# Altium schematic sheet SM3320-BATT-EV.SchDoc: ChangeMe
size C; Date: Not shown in title block; ApprovedBy: Not shown in title block; CheckedBy: Not shown in title block; Author: Not shown in title block; CompanyName: Not shown in title block; DrawnBy: Not shown in title block; Engineer: Not shown in title block; Organization: Not shown in title block; Address1: Not shown in title block; Address2: Not shown in title block; Address3: Not shown in title block; Address4: Not shown in title block; DocumentNumber: 1; Revision: Use project parameter SCH_Rev; SheetNumber: 1; SheetTotal: 1; PageSetup: Record=PageOptions|CenterHorizontal=True|CenterVertical=True|PrintScale=0.85|XCorrection=0.00|YCorrection=0.00|PrintKind=2|BorderSize=5000000|LeftOffset=0|BottomOffset=0|Orientation=2|PaperLength=1000|PaperWidth=1000|Scale=100|PaperSource=15|PrintQuality=600|MediaType=1|DitherType=10|PaperKind=11x17|PrintScaleMode=0; CurrentTime: Not shown in title block; CurrentDate: Not shown in title block; Time: Not shown in title block; DocumentFullPathAndName: Not shown in title block; DocumentName: Not shown in title block; ModifiedDate: Not shown in title block; ImagePath: Not shown in title block
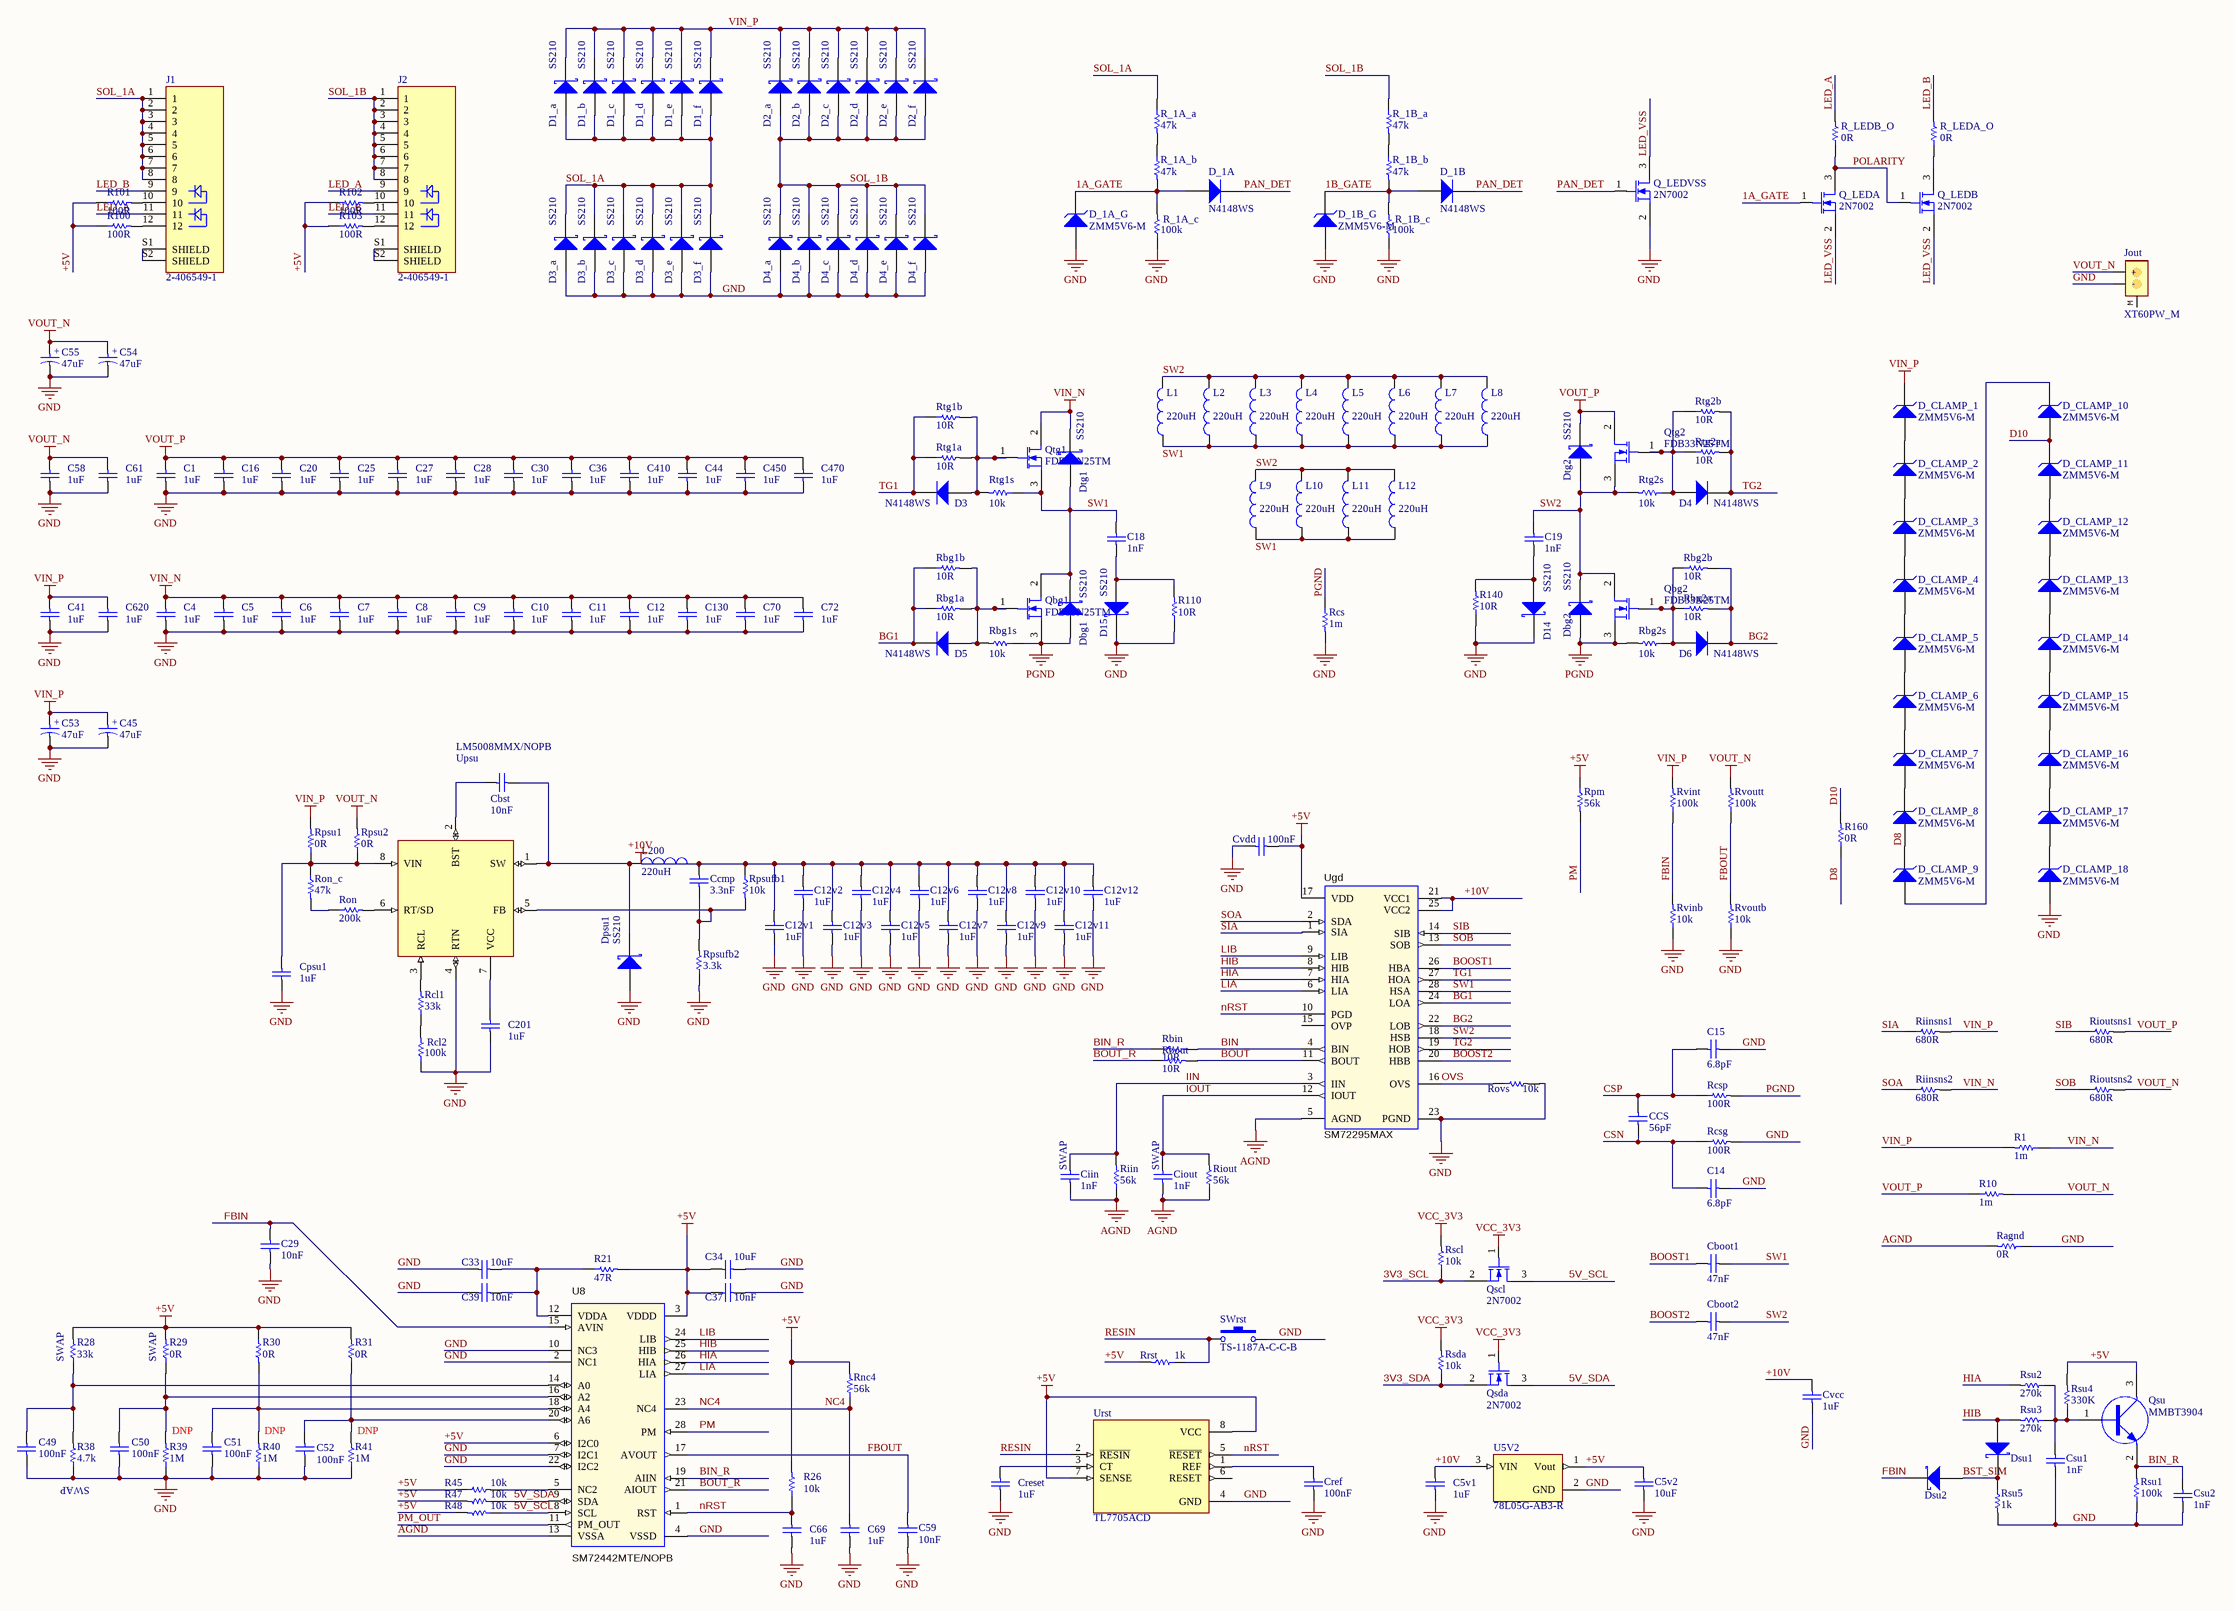
[diagram p0: SM3320-BATT-EV.SchDoc]

## Parts
C1  value 1uF  [C_1206]  (hidden comment: 1206B105K101NT)
C4  value 1uF  [C_1206]  (hidden comment: 1206B105K101NT)
C5  value 1uF  [C_1206]  (hidden comment: 1206B105K101NT)
C5v1  value 1uF  [C_0402]  (hidden comment: CL05A105KA5NQNC)
C5v2  value 10uF  [C_0402]  (hidden comment: CL05A106MQ5NUNC)
C6  value 1uF  [C_1206]  (hidden comment: 1206B105K101NT)
C7  value 1uF  [C_1206]  (hidden comment: 1206B105K101NT)
C8  value 1uF  [C_1206]  (hidden comment: 1206B105K101NT)
C9  value 1uF  [C_1206]  (hidden comment: 1206B105K101NT)
C10  value 1uF  [C_1206]  (hidden comment: 1206B105K101NT)
C11  value 1uF  [C_1206]  (hidden comment: 1206B105K101NT)
C12  value 1uF  [C_1206]  (hidden comment: 1206B105K101NT)
C12v1  value 1uF  [C_0402]  (hidden comment: CL05A105KA5NQNC)
C12v2  value 1uF  [C_0402]  (hidden comment: CL05A105KA5NQNC)
C12v3  value 1uF  [C_0402]  (hidden comment: CL05A105KA5NQNC)
C12v4  value 1uF  [C_0402]  (hidden comment: CL05A105KA5NQNC)
C12v5  value 1uF  [C_0402]  (hidden comment: CL05A105KA5NQNC)
C12v6  value 1uF  [C_0402]  (hidden comment: CL05A105KA5NQNC)
C12v7  value 1uF  [C_0402]  (hidden comment: CL05A105KA5NQNC)
C12v8  value 1uF  [C_0402]  (hidden comment: CL05A105KA5NQNC)
C12v9  value 1uF  [C_0402]  (hidden comment: CL05A105KA5NQNC)
C12v10  value 1uF  [C_0402]  (hidden comment: CL05A105KA5NQNC)
C12v11  value 1uF  [C_0402]  (hidden comment: CL05A105KA5NQNC)
C12v12  value 1uF  [C_0402]  (hidden comment: CL05A105KA5NQNC)
C14  value 6.8pF  [C_0402]  (hidden comment: 0402CG6R8C500NT)
C15  value 6.8pF  [C_0402]  (hidden comment: 0402CG6R8C500NT)
C16  value 1uF  [C_1206]  (hidden comment: 1206B105K101NT)
C18  value 1nF  [C_1206]  (hidden comment: 1206B102K202NT)
C19  value 1nF  [C_1206]  (hidden comment: 1206B102K202NT)
C20  value 1uF  [C_1206]  (hidden comment: 1206B105K101NT)
C25  value 1uF  [C_1206]  (hidden comment: 1206B105K101NT)
C27  value 1uF  [C_1206]  (hidden comment: 1206B105K101NT)
C28  value 1uF  [C_1206]  (hidden comment: 1206B105K101NT)
C29  value 10nF  [C_0402]  (hidden comment: CL05B103KB5NNNC)
C30  value 1uF  [C_1206]  (hidden comment: 1206B105K101NT)
C33  value 10uF  [C_0402]  (hidden comment: CL05A106MQ5NUNC)
C34  value 10uF  [C_0402]  (hidden comment: CL05A106MQ5NUNC)
C36  value 1uF  [C_1206]  (hidden comment: 1206B105K101NT)
C37  value 10nF  [C_0402]  (hidden comment: CL05B103KB5NNNC)
C39  value 10nF  [C_0402]  (hidden comment: CL05B103KB5NNNC)
C41  value 1uF  [C_1206]  (hidden comment: 1206B105K101NT)
C44  value 1uF  [C_1206]  (hidden comment: 1206B105K101NT)
C45  value 47uF  [C_CAN_1010]  (hidden comment: VZH470M2ATR-1010)
C49  value 100nF  [C_0402]  (hidden comment: CL05B104KO5NNNC)
C50  value 100nF  [C_0402]  (hidden comment: CL05B104KO5NNNC)
C51  value 100nF  [C_0402]  (hidden comment: CL05B104KO5NNNC)
C52  value 100nF  [C_0402]  (hidden comment: CL05B104KO5NNNC)
C53  value 47uF  [C_CAN_1010]  (hidden comment: VZH470M2ATR-1010)
C54  value 47uF  [C_CAN_1010]  (hidden comment: VZH470M2ATR-1010)
C55  value 47uF  [C_CAN_1010]  (hidden comment: VZH470M2ATR-1010)
C58  value 1uF  [C_1206]  (hidden comment: 1206B105K101NT)
C59  value 10nF  [C_0402]  (hidden comment: CL05B103KB5NNNC)
C61  value 1uF  [C_1206]  (hidden comment: 1206B105K101NT)
C66  value 1uF  [C_0402]  (hidden comment: CL05A105KA5NQNC)
C69  value 1uF  [C_0402]  (hidden comment: CL05A105KA5NQNC)
C70  value 1uF  [C_1206]  (hidden comment: 1206B105K101NT)
C72  value 1uF  [C_1206]  (hidden comment: 1206B105K101NT)
C130  value 1uF  [C_1206]  (hidden comment: 1206B105K101NT)
C201  value 1uF  [C_0402]  (hidden comment: CL05A105KA5NQNC)
C410  value 1uF  [C_1206]  (hidden comment: 1206B105K101NT)
C450  value 1uF  [C_1206]  (hidden comment: 1206B105K101NT)
C470  value 1uF  [C_1206]  (hidden comment: 1206B105K101NT)
C620  value 1uF  [C_1206]  (hidden comment: 1206B105K101NT)
Cboot1  value 47nF  [C_0603]  (hidden comment: CL10B474KA8NNNC)
Cboot2  value 47nF  [C_0603]  (hidden comment: CL10B474KA8NNNC)
Cbst  value 10nF  [C_0402]  (hidden comment: CL05B103KB5NNNC)
Ccmp  value 3.3nF  [C_0402]  (hidden comment: CL05B332KB5NNNC)
CCS  value 56pF  [C_0402]  (hidden comment: 0402CG560J500NT)
Ciin  value 1nF  [C_0402]  (hidden comment: 0402B102K500NT)
Ciout  value 1nF  [C_0402]  (hidden comment: 0402B102K500NT)
Cpsu1  value 1uF  [C_1206]  (hidden comment: 1206B105K101NT)
Cref  value 100nF  [C_0402]  (hidden comment: CL05B104KO5NNNC)
Creset  value 1uF  [C_0402]  (hidden comment: CL05A105KA5NQNC)
Csu1  value 1nF  [C_0402]  (hidden comment: 0402B102K500NT)
Csu2  value 1nF  [C_0402]  (hidden comment: 0402B102K500NT)
Cvcc  value 1uF  [C_0402]  (hidden comment: CL05A105KA5NQNC)
Cvdd  value 100nF  [C_0402]  (hidden comment: CL05B104KO5NNNC)
D1_a  SS210  [DO-214AC]
D1_b  SS210  [DO-214AC]
D1_c  SS210  [DO-214AC]
D1_d  SS210  [DO-214AC]
D1_e  SS210  [DO-214AC]
D1_f  SS210  [DO-214AC]
D2_a  SS210  [DO-214AC]
D2_b  SS210  [DO-214AC]
D2_c  SS210  [DO-214AC]
D2_d  SS210  [DO-214AC]
D2_e  SS210  [DO-214AC]
D2_f  SS210  [DO-214AC]
D3  N4148WS  [SOD-323]
D3_a  SS210  [DO-214AC]
D3_b  SS210  [DO-214AC]
D3_c  SS210  [DO-214AC]
D3_d  SS210  [DO-214AC]
D3_e  SS210  [DO-214AC]
D3_f  SS210  [DO-214AC]
D4  N4148WS  [SOD-323]
D4_a  SS210  [DO-214AC]
D4_b  SS210  [DO-214AC]
D4_c  SS210  [DO-214AC]
D4_d  SS210  [DO-214AC]
D4_e  SS210  [DO-214AC]
D4_f  SS210  [DO-214AC]
D5  N4148WS  [SOD-323]
D6  N4148WS  [SOD-323]
D14  SS210  [DO-214AC]
D15  SS210  [DO-214AC]
D_1A  N4148WS  [SOD-323]
D_1A_G  ZMM5V6-M  [DO-213AA]
D_1B  N4148WS  [SOD-323]
D_1B_G  ZMM5V6-M  [DO-213AA]
D_CLAMP_1  ZMM5V6-M  [DO-213AA]
D_CLAMP_2  ZMM5V6-M  [DO-213AA]
D_CLAMP_3  ZMM5V6-M  [DO-213AA]
D_CLAMP_4  ZMM5V6-M  [DO-213AA]
D_CLAMP_5  ZMM5V6-M  [DO-213AA]
D_CLAMP_6  ZMM5V6-M  [DO-213AA]
D_CLAMP_7  ZMM5V6-M  [DO-213AA]
D_CLAMP_8  ZMM5V6-M  [DO-213AA]
D_CLAMP_9  ZMM5V6-M  [DO-213AA]
D_CLAMP_10  ZMM5V6-M  [DO-213AA]
D_CLAMP_11  ZMM5V6-M  [DO-213AA]
D_CLAMP_12  ZMM5V6-M  [DO-213AA]
D_CLAMP_13  ZMM5V6-M  [DO-213AA]
D_CLAMP_14  ZMM5V6-M  [DO-213AA]
D_CLAMP_15  ZMM5V6-M  [DO-213AA]
D_CLAMP_16  ZMM5V6-M  [DO-213AA]
D_CLAMP_17  ZMM5V6-M  [DO-213AA]
D_CLAMP_18  ZMM5V6-M  [DO-213AA]
Dbg1  SS210  [DO-214AC]
Dbg2  SS210  [DO-214AC]
Dpsu1  SS210  [DO-214AC]
Dsu1  1N5819WS  [SOD-323]  (value not drawn)
Dsu2  1N5819WS  [SOD-323]  (value not drawn)
Dtg1  SS210  [DO-214AC]
Dtg2  SS210  [DO-214AC]
J1  2-406549-1  [TE_2-406549-1]
J2  2-406549-1  [TE_2-406549-1]
Jout  XT60PW_M  [XT60PW_M]
L1  value 220uH  [SRR1260]  (hidden comment: SWRB1207S-221MT)
L2  value 220uH  [SRR1260]  (hidden comment: SWRB1207S-221MT)
L3  value 220uH  [SRR1260]  (hidden comment: SWRB1207S-221MT)
L4  value 220uH  [SRR1260]  (hidden comment: SWRB1207S-221MT)
L5  value 220uH  [SRR1260]  (hidden comment: SWRB1207S-221MT)
L6  value 220uH  [SRR1260]  (hidden comment: SWRB1207S-221MT)
L7  value 220uH  [SRR1260]  (hidden comment: SWRB1207S-221MT)
L8  value 220uH  [SRR1260]  (hidden comment: SWRB1207S-221MT)
L9  value 220uH  [SRR1260]  (hidden comment: SWRB1207S-221MT)
L10  value 220uH  [SRR1260]  (hidden comment: SWRB1207S-221MT)
L11  value 220uH  [SRR1260]  (hidden comment: SWRB1207S-221MT)
L12  value 220uH  [SRR1260]  (hidden comment: SWRB1207S-221MT)
L200  value 220uH  [SRR1260]  (hidden comment: SWRB1207S-221MT)
Q_LEDA  2N7002  [TO-236AB]
Q_LEDB  2N7002  [TO-236AB]
Q_LEDVSS  2N7002  [TO-236AB]
Qbg1  FDB33N25TM  [TO-263-3]
Qbg2  FDB33N25TM  [TO-263-3]
Qscl  2N7002  [TO-236AB]
Qsda  2N7002  [TO-236AB]
Qsu  MMBT3904  [TO-236AB]
Qtg1  FDB33N25TM  [TO-263-3]
Qtg2  FDB33N25TM  [TO-263-3]
R1  1m  [R_2512]
R10  1m  [R_2512]
R21  value 47R  [R_0402]  (hidden comment: 0402WGF470JTCE)
R26  value 10k  [R_0402]  (hidden comment: 0402WGF1002TCE)
R28  value 33k  [R_0402]  (hidden comment: 0402WGF3302TCE)
R29  value 0R  [R_0402]  (hidden comment: 0402WGF0000TCE)
R30  value 0R  [R_0402]  (hidden comment: 0402WGF0000TCE)
R31  value 0R  [R_0402]  (hidden comment: 0402WGF0000TCE)
R38  value 4.7k  [R_0402]  (hidden comment: 0402WGF4701TCE)
R39  value 1M  [R_0402]  (hidden comment: 0402WGF1004TCE)
R40  value 1M  [R_0402]  (hidden comment: 0402WGF1004TCE)
R41  value 1M  [R_0402]  (hidden comment: 0402WGF1004TCE)
R45  value 10k  [R_0402]  (hidden comment: 0402WGF1002TCE)
R47  value 10k  [R_0402]  (hidden comment: 0402WGF1002TCE)
R48  value 10k  [R_0402]  (hidden comment: 0402WGF1002TCE)
R100  value 100R  [R_0402]  (hidden comment: 0402WGF1000TCE)
R101  value 100R  [R_0402]  (hidden comment: 0402WGF1000TCE)
R102  value 100R  [R_0402]  (hidden comment: 0402WGF1000TCE)
R103  value 100R  [R_0402]  (hidden comment: 0402WGF1000TCE)
R110  value 10R  [R_1206]  (hidden comment: 1206W4F100JT5E)
R140  value 10R  [R_1206]  (hidden comment: 1206W4F100JT5E)
R160  value 0R  [R_0402]  (hidden comment: 0402WGF0000TCE)
R_1A_a  value 47k  [R_0402]  (hidden comment: 0402WGF4702TCE)
R_1A_b  value 47k  [R_0402]  (hidden comment: 0402WGF4702TCE)
R_1A_c  value 100k  [R_0402]  (hidden comment: 0402WGF1003TCE)
R_1B_a  value 47k  [R_0402]  (hidden comment: 0402WGF4702TCE)
R_1B_b  value 47k  [R_0402]  (hidden comment: 0402WGF4702TCE)
R_1B_c  value 100k  [R_0402]  (hidden comment: 0402WGF1003TCE)
R_LEDA_O  value 0R  [R_0402]  (hidden comment: 0402WGF0000TCE)
R_LEDB_O  value 0R  [R_0402]  (hidden comment: 0402WGF0000TCE)
Ragnd  value 0R  [R_0402]  (hidden comment: 0402WGF0000TCE)
Rbg1a  value 10R  [R_0402]  (hidden comment: 0402WGF100JTCE)
Rbg1b  value 10R  [R_0402]  (hidden comment: 0402WGF100JTCE)
Rbg1s  value 10k  [R_0402]  (hidden comment: 0402WGF1002TCE)
Rbg2a  value 10R  [R_0402]  (hidden comment: 0402WGF100JTCE)
Rbg2b  value 10R  [R_0402]  (hidden comment: 0402WGF100JTCE)
Rbg2s  value 10k  [R_0402]  (hidden comment: 0402WGF1002TCE)
Rbin  value 10R  [R_0402]  (hidden comment: 0402WGF100JTCE)
Rbout  value 10R  [R_0402]  (hidden comment: 0402WGF100JTCE)
Rcl1  value 33k  [R_0402]  (hidden comment: 0402WGF3302TCE)
Rcl2  value 100k  [R_0402]  (hidden comment: 0402WGF1003TCE)
Rcs  1m  [R_2512]
Rcsg  value 100R  [R_0402]  (hidden comment: 0402WGF1000TCE)
Rcsp  value 100R  [R_0402]  (hidden comment: 0402WGF1000TCE)
Riin  value 56k  [R_0402]  (hidden comment: 0402WGF5602TCE)
Riinsns1  value 680R  [R_0603]  (hidden comment: 0603WAF6800T5E)
Riinsns2  value 680R  [R_0603]  (hidden comment: 0603WAF6800T5E)
Riout  value 56k  [R_0402]  (hidden comment: 0402WGF5602TCE)
Rioutsns1  value 680R  [R_0603]  (hidden comment: 0603WAF6800T5E)
Rioutsns2  value 680R  [R_0603]  (hidden comment: 0603WAF6800T5E)
Rnc4  value 56k  [R_0402]  (hidden comment: 0402WGF5602TCE)
Ron  value 200k  [R_0402]  (hidden comment: 0402WGF2003TCE)
Ron_c  value 47k  [R_0402]  (hidden comment: 0402WGF4702TCE)
Rovs  value 10k  [R_0402]  (hidden comment: 0402WGF1002TCE)
Rpm  value 56k  [R_0402]  (hidden comment: 0402WGF5602TCE)
Rpsu1  value 0R  [R_0402]  (hidden comment: 0402WGF0000TCE)
Rpsu2  value 0R  [R_0402]  (hidden comment: 0402WGF0000TCE)
Rpsufb1  value 10k  [R_0402]  (hidden comment: 0402WGF1002TCE)
Rpsufb2  value 3.3k  [R_0402]  (hidden comment: 0402WGF3301TCE)
Rrst  value 1k  [R_0402]  (hidden comment: 0402WGF1001TCE)
Rscl  value 10k  [R_0402]  (hidden comment: 0402WGF1002TCE)
Rsda  value 10k  [R_0402]  (hidden comment: 0402WGF1002TCE)
Rsu1  value 100k  [R_0402]  (hidden comment: 0402WGF1003TCE)
Rsu2  value 270k  [R_0603]  (hidden comment: 0603WAF2703T5E)
Rsu3  value 270k  [R_0603]  (hidden comment: 0603WAF2703T5E)
Rsu4  value 330K  [R_0402]  (hidden comment: 0402WGF3303TCE)
Rsu5  value 1k  [R_0402]  (hidden comment: 0402WGF1001TCE)
Rtg1a  value 10R  [R_0402]  (hidden comment: 0402WGF100JTCE)
Rtg1b  value 10R  [R_0402]  (hidden comment: 0402WGF100JTCE)
Rtg1s  value 10k  [R_0402]  (hidden comment: 0402WGF1002TCE)
Rtg2a  value 10R  [R_0402]  (hidden comment: 0402WGF100JTCE)
Rtg2b  value 10R  [R_0402]  (hidden comment: 0402WGF100JTCE)
Rtg2s  value 10k  [R_0402]  (hidden comment: 0402WGF1002TCE)
Rvinb  value 10k  [R_0603]  (hidden comment: 0603WAF1002T5E)
Rvint  value 100k  [R_0603]  (hidden comment: 0603WAF1003T5E)
Rvoutb  value 10k  [R_0603]  (hidden comment: 0603WAF1002T5E)
Rvoutt  value 100k  [R_0603]  (hidden comment: 0603WAF1003T5E)
SWrst  TS-1187A-C-C-B  [TS-1187A-C-C-B]
U5V2  78L05G-AB3-R  [SOT-223-3]
U8  SM72442MTE/NOPB  [MTC28_L]
Ugd  SM72295MAX  [M28B_M]
Upsu  LM5008MMX/NOPB  [SOP65P490X110-8N]
Urst  TL7705ACD  [SOIC-8-P1.27-W3.5]

## Nets
+5V: C5v2.2 C34.2 C37.1 Cvdd.2 Qsu.3(C) R21.2 R26.2 R28.2 R29.2 R30.1 R31.2 R45.1 R47.2 R48.2 R100.1 R101.1 R102.1 R103.1 Rnc4.2 Rpm.1 Rrst.2 Rsu4.2 U5V2.1(Vout) U8.3(VDDD) U8.6(I2C0) Ugd.17(VDD) Urst.7(SENSE) Urst.8(VCC)
+10V: C5v1.2 C12v1.1 C12v2.1 C12v3.1 C12v4.1 C12v5.1 C12v6.1 C12v7.1 C12v8.1 C12v9.1 C12v10.1 C12v11.1 C12v12.1 Ccmp.2 Cvcc.2 L200.2 Rpsufb1.1 U5V2.3(VIN) Ugd.21(VCC1) Ugd.25(VCC2)
AGND: Ciin.1 Ciout.1 Ragnd.2 Riin.1 Riout.1 U8.13(VSSA) Ugd.5(AGND)
GND: C1.1 C4.1 C5.1 C5v1.1 C5v2.1 C6.1 C7.1 C8.1 C9.1 C10.1 C11.1 C12.1 C12v1.2 C12v2.2 C12v3.2 C12v4.2 C12v5.2 C12v6.2 C12v7.2 C12v8.2 C12v9.2 C12v10.2 C12v11.2 C12v12.2 C14.2 C15.2 C16.1 C20.1 C25.1 C27.1 C28.1 C29.1 C30.1 C33.2 C34.1 C36.1 C37.2 C39.1 C41.1 C44.1 C45.1 C49.1 C50.1 C51.1 C52.2 C53.1 C54.1 C55.1 C58.1 C59.1 C61.1 C66.1 C69.1 C70.1 C72.1 C130.1 C201.2 C410.1 C450.1 C470.1 C620.1 Cpsu1.1 Cref.1 Creset.1 Csu1.1 Csu2.1 Cvcc.1 Cvdd.1 D3_a.2(A) D3_b.2(A) D3_c.2(A) D3_d.2(A) D3_e.2(A) D3_f.2(A) D4_a.2(A) D4_b.2(A) D4_c.2(A) D4_d.2(A) D4_e.2(A) D4_f.2(A) D14.1(K) D15.1(K) D_1A_G.2(A) D_1B_G.2(A) D_CLAMP_18.2(A) Dpsu1.2(A) Jout.MINUS(-) Q_LEDVSS.2(S) R38.1 R39.1 R40.1 R41.1 R110.1 R140.1 R_1A_c.1 R_1B_c.1 Ragnd.1 Rcl2.1 Rcs.2 Rcsg.2 Rovs.2 Rpsufb2.1 Rsu1.1 Rsu5.2 Rvinb.1 Rvoutb.1 SWrst.2 U5V2.2(GND) U8.2(NC1) U8.4(VSSD) U8.7(I2C1) U8.10(NC3) U8.22(I2C2) Ugd.23(PGND) Upsu.4(RTN) Urst.4(GND)
PGND: Dbg1.2(A) Dbg2.2(A) Qbg1.3(S) Qbg2.3(S) Rbg1s.1 Rbg2s.2 Rcs.1 Rcsp.2
VCC_3V3: Qscl.1(G) Qsda.1(G) Rscl.2 Rsda.2
VIN_N: C4.2 C5.2 C6.2 C7.2 C8.2 C9.2 C10.2 C11.2 C12.2 C70.2 C72.2 C130.2 Dtg1.1(K) Qtg1.2(D) R1.1 Riinsns2.2
VIN_P: C41.2 C45.2 C53.2 C620.2 D1_a.1(K) D1_b.1(K) D1_c.1(K) D1_d.1(K) D1_e.1(K) D1_f.1(K) D2_a.1(K) D2_b.1(K) D2_c.1(K) D2_d.1(K) D2_e.1(K) D2_f.1(K) D_CLAMP_1.1(K) R1.2 Riinsns1.2 Rpsu1.2 Rvint.2
VOUT_N: C54.2 C55.2 C58.2 C61.2 Jout.PLUS(+) R10.2 Rioutsns2.2 Rpsu2.2 Rvoutt.2
VOUT_P: C1.2 C16.2 C20.2 C25.2 C27.2 C28.2 C30.2 C36.2 C44.2 C410.2 C450.2 C470.2 Dtg2.1(K) Qtg2.2(D) R10.1 Rioutsns1.2
1A_GATE: D_1A.2(A) D_1A_G.1(K) Q_LEDA.1(G) R_1A_b.2 R_1A_c.2
1B_GATE: D_1B.2(A) D_1B_G.1(K) R_1B_b.2 R_1B_c.2
3V3_SCL: Qscl.2(S) Rscl.1
3V3_SDA: Qsda.2(S) Rsda.1
5V_SCL: Qscl.3(D) R48.1 U8.8(SCL)
5V_SDA: Qsda.3(D) R47.1 U8.9(SDA)
BG1: D5.1(K) Rbg1a.1 Rbg1b.1 Ugd.24(LOA)
BG2: D6.1(K) Rbg2a.2 Rbg2b.2 Ugd.22(LOB)
BIN: Rbin.2 Ugd.4(BIN)
BIN_R: Csu2.2 Qsu.2(E) Rbin.1 Rsu1.2 U8.19(AIIN)
BOOST1: Cboot1.2 Ugd.26(HBA)
BOOST2: Cboot2.2 Ugd.20(HBB)
BOUT: Rbout.2 Ugd.11(BOUT)
BOUT_R: Rbout.1 U8.21(AIOUT)
BST_SIM: Dsu1.1(K) Dsu2.2(A) Rsu5.1
CSN: C14.1 CCS.1 Rcsg.1
CSP: C15.1 CCS.2 Rcsp.1
D8: D_CLAMP_8.2(A) D_CLAMP_9.1(K) R160.1
D10: D_CLAMP_10.2(A) D_CLAMP_11.1(K) R160.2
FBIN: C29.2 Dsu2.1(K) Rvinb.2 Rvint.1 U8.15(AVIN)
FBOUT: C59.2 Rvoutb.2 Rvoutt.1 U8.17(AVOUT)
HIA: Rsu2.2 U8.26(HIA) Ugd.7(HIA)
HIB: Dsu1.2(A) Rsu3.2 U8.25(HIB) Ugd.8(HIB)
IIN: Ciin.2 Riin.2 Ugd.3(IIN)
IOUT: Ciout.2 Riout.2 Ugd.12(IOUT)
LED_A: J1.11 J2.9 R_LEDB_O.2
LED_B: J1.9 J2.11 R_LEDA_O.2
LED_VSS: Q_LEDA.2(S) Q_LEDB.2(S) Q_LEDVSS.3(D)
LIA: U8.27(LIA) Ugd.6(LIA)
LIB: U8.24(LIB) Ugd.9(LIB)
NC4: C69.2 Rnc4.1 U8.23(NC4)
nRST: C66.2 R26.1 U8.1(RST) Ugd.10(PGD) Urst.5(~{RESET})
OVS: Rovs.1 Ugd.16(OVS)
PAN_DET: D_1A.1(K) D_1B.1(K) Q_LEDVSS.1(G)
PM: Rpm.2 U8.28(PM)
PM_OUT: U8.11(PM_OUT)
POLARITY: Q_LEDA.3(D) Q_LEDB.1(G) R_LEDB_O.1
RESIN: Rrst.1 SWrst.1 Urst.2(~{RESIN})
SIA: Riinsns1.1 Ugd.1(SIA)
SIB: Rioutsns1.1 Ugd.14(SIB)
SOA: Riinsns2.1 Ugd.2(SDA)
SOB: Rioutsns2.1 Ugd.13(SOB)
SOL_1A: D1_a.2(A) D1_b.2(A) D1_c.2(A) D1_d.2(A) D1_e.2(A) D1_f.2(A) D3_a.1(K) D3_b.1(K) D3_c.1(K) D3_d.1(K) D3_e.1(K) D3_f.1(K) J1.1 J1.2 J1.3 J1.4 J1.5 J1.6 J1.7 J1.8 R_1A_a.1
SOL_1B: D2_a.2(A) D2_b.2(A) D2_c.2(A) D2_d.2(A) D2_e.2(A) D2_f.2(A) D4_a.1(K) D4_b.1(K) D4_c.1(K) D4_d.1(K) D4_e.1(K) D4_f.1(K) J2.1 J2.2 J2.3 J2.4 J2.5 J2.6 J2.7 J2.8 R_1B_a.1
SW1: C18.2 Cboot1.1 Dbg1.1(K) Dtg1.2(A) L1.1 L2.1 L3.1 L4.1 L5.1 L6.1 L7.1 L8.1 L9.1 L10.1 L11.1 L12.1 Qbg1.2(D) Qtg1.3(S) Rtg1s.1 Ugd.28(HSA)
SW2: C19.2 Cboot2.1 Dbg2.1(K) Dtg2.2(A) L1.2 L2.2 L3.2 L4.2 L5.2 L6.2 L7.2 L8.2 L9.2 L10.2 L11.2 L12.2 Qbg2.2(D) Qtg2.3(S) Rtg2s.2 Ugd.18(HSB)
TG1: D3.1(K) Rtg1a.1 Rtg1b.1 Ugd.27(HOA)
TG2: D4.1(K) Rtg2a.2 Rtg2b.2 Ugd.19(HOB)
NetC18_1: C18.1 D15.2(A) R110.2
NetC19_1: C19.1 D14.2(A) R140.2
NetC33_1: C33.1 C39.2 R21.1 U8.12(VDDA)
NetC49_2: C49.2 R28.1 R38.2 U8.14(A0)
NetC50_2: C50.2 R29.1 R39.2 U8.16(A2)
NetC51_2: C51.2 R30.2 R40.2 U8.18(A4)
NetC52_1: C52.1 R31.1 R41.2 U8.20(A6)
NetC201_1: C201.1 Upsu.7(VCC)
NetCbst_1: Cbst.1 Upsu.2(BST)
NetCbst_2: Cbst.2 Dpsu1.1(K) L200.1 Upsu.1(SW)
NetCcmp_1: Ccmp.1 Rpsufb1.2 Rpsufb2.2 Upsu.5(FB)
NetCpsu1_2: Cpsu1.2 Ron_c.1 Rpsu1.1 Rpsu2.1 Upsu.8(VIN)
NetCref_2: Cref.2 Urst.1(REF)
NetCreset_2: Creset.2 Urst.3(CT)
NetCsu1_2: Csu1.2 Qsu.1(B) Rsu2.1 Rsu3.1 Rsu4.1
NetD3_2: D3.2(A) Qtg1.1(G) Rtg1a.2 Rtg1b.2 Rtg1s.2
NetD4_2: D4.2(A) Qtg2.1(G) Rtg2a.1 Rtg2b.1 Rtg2s.1
NetD5_2: D5.2(A) Qbg1.1(G) Rbg1a.2 Rbg1b.2 Rbg1s.2
NetD6_2: D6.2(A) Qbg2.1(G) Rbg2a.1 Rbg2b.1 Rbg2s.1
NetD_CLAMP_1_2: D_CLAMP_1.2(A) D_CLAMP_2.1(K)
NetD_CLAMP_2_2: D_CLAMP_2.2(A) D_CLAMP_3.1(K)
NetD_CLAMP_3_2: D_CLAMP_3.2(A) D_CLAMP_4.1(K)
NetD_CLAMP_4_2: D_CLAMP_4.2(A) D_CLAMP_5.1(K)
NetD_CLAMP_5_2: D_CLAMP_5.2(A) D_CLAMP_6.1(K)
NetD_CLAMP_6_2: D_CLAMP_6.2(A) D_CLAMP_7.1(K)
NetD_CLAMP_7_2: D_CLAMP_7.2(A) D_CLAMP_8.1(K)
NetD_CLAMP_9_2: D_CLAMP_9.2(A) D_CLAMP_10.1(K)
NetD_CLAMP_11_2: D_CLAMP_11.2(A) D_CLAMP_12.1(K)
NetD_CLAMP_12_2: D_CLAMP_12.2(A) D_CLAMP_13.1(K)
NetD_CLAMP_13_2: D_CLAMP_13.2(A) D_CLAMP_14.1(K)
NetD_CLAMP_14_2: D_CLAMP_14.2(A) D_CLAMP_15.1(K)
NetD_CLAMP_15_2: D_CLAMP_15.2(A) D_CLAMP_16.1(K)
NetD_CLAMP_16_2: D_CLAMP_16.2(A) D_CLAMP_17.1(K)
NetD_CLAMP_17_2: D_CLAMP_17.2(A) D_CLAMP_18.1(K)
NetJ1_10: J1.10 R101.2
NetJ1_12: J1.12 R100.2
NetJ1_S1: J1.S1(SHIELD) J1.S2(SHIELD)
NetJ2_10: J2.10 R102.2
NetJ2_12: J2.12 R103.2
NetJ2_S1: J2.S1(SHIELD) J2.S2(SHIELD)
NetQ_LEDB_3: Q_LEDB.3(D) R_LEDA_O.1
NetR45_2: R45.2 U8.5(NC2)
NetR_1A_a_2: R_1A_a.2 R_1A_b.1
NetR_1B_a_2: R_1B_a.2 R_1B_b.1
NetRcl1_1: Rcl1.1 Rcl2.2
NetRcl1_2: Rcl1.2 Upsu.3(RCL)
NetRon_1: Ron.1 Ron_c.2
NetRon_2: Ron.2 Upsu.6(RT/SD)

Not connected (* = marked no-connect by the designer): Jout M; Ugd 15(OVP); Urst 6(RESET)

## Notes on the sheet
- (near Ciin) SWAP
- (near Ciout) SWAP
- (near R28) SWAP
- (near R29) SWAP
- (near R39) DNP
- (near R40) DNP
- (near R41) DNP
- (near R38) SWAP
- Title
- Size:
- Date:
- File:
- C
- Number:
- Time:
- Revision:
- Sheet
- of
- (in symbol VZH470M2ATR-1010) +

## Library data of the parts
C1 C4-C12 C16 C20 C25 C27 C28 C30 C36 C41 C44 C58 C61 C70 C72 C130 C410 C450 C470 C620 Cpsu1 = 1206B105K101NT: C - CAPACITOR - MLCC - 1uF - 100V - 1206 - X7R; WVDC: 100; LCSC Part #: C91151; JLC Availability: Extended
C5v1 C12v1-C12v12 C66 C69 C201 Creset Cvcc = CL05A105KA5NQNC: C - CAPACITOR - MLCC - 1uF - 25V - 0402; WVDC: 16; LCSC Part #: C52923; JLC Availability: Basic
C5v2 C33 C34 = CL05A106MQ5NUNC: C - CAPACITOR - MLCC - 10uF - 6.3V - 0402; WVDC: 6.3; LCSC Part #: C15525; JLC Availability: Basic
C14 C15 = 0402CG6R8C500NT: C - CAPACITOR - MLCC - 6.8pF - 50V - 0402; WVDC: 50; LCSC Part #: C1576; JLC Availability: Basic
C18 C19 = 1206B102K202NT: C - CAPACITOR - MLCC - 1nF - 2000V - 1206 - X7R; WVDC: 2000; LCSC Part #: C9196; JLC Availability: Basic
C29 C37 C39 C59 Cbst = CL05B103KB5NNNC: C - CAPACITOR - MLCC - 10nF - 50V - 0402; WVDC: 50; LCSC Part #: C15195; JLC Availability: Basic
C45 C53-C55 = VZH470M2ATR-1010: C - CAPACITOR - ELECTROLYTIC - 47uF - 100V; WVDC: 100; ESR: 40mOhm; LCSC Part #: C164068; JLC Availability: Extended
C49-C52 Cref Cvdd = CL05B104KO5NNNC: C - CAPACITOR - MLCC - 100nF - 16V - 0402; WVDC: 16; LCSC Part #: C1525; JLC Availability: Basic
Cboot1 Cboot2 = CL10B474KA8NNNC: C - CAPACITOR - MLCC - 470nF - 25V - 0603; WVDC: 25; LCSC Part #: C1623; JLC Availability: Basic
Ccmp = CL05B332KB5NNNC: C - CAPACITOR - MLCC - 3.3nF - 50V - 0402; WVDC: 50; LCSC Part #: C26404; JLC Availability: Basic
CCS = 0402CG560J500NT: C - CAPACITOR - MLCC - 56pF - 50V -  0402; WVDC: 50; LCSC Part #: C1572; JLC Availability: Basic
Ciin Ciout Csu1 Csu2 = 0402B102K500NT: C - CAPACITOR - MLCC - 1nF - 50V - 0402; WVDC: 50; LCSC Part #: C1523; JLC Availability: Basic
D1_a D1_b D1_c D1_d D1_e D1_f D2_a D2_b D2_c D2_d D2_e D2_f D3_a D3_b D3_c D3_d D3_e D3_f D4_a D4_b D4_c D4_d D4_e D4_f D14 D15 Dbg1 Dbg2 Dpsu1 Dtg1 Dtg2 = SS210: D - DIODE - SCHOTTKY - 100V - 2A; Vrrm: 100; If: 2A; LCSC Part #: C14996; JLC Availability: Extended
D3-D6 D_1A D_1B = N4148WS: D - DIODE - FAST TRR - 100V - 150mA - 4ns; LCSC Part #: C2128; JLC Availability: Basic; PIV: 100V; If: 150mA; Trr: 4ns
D_1A_G D_1B_G D_CLAMP_1-D_CLAMP_18 = ZMM5V6-M: D - DIODE - ZENER - 5.6V - 500mW; LCSC Part #: C8062; JLC Availability: BASIC
Dsu1 Dsu2 = 1N5819WS: D - DIODE - SCHOTTKY - 40V - 1A; Trr: 4ns; LCSC Part #: C191023; JLC Availability: Basic; PIV: 40V; If: 1A
J1 J2 = 2-406549-1: J - JACK - ETHERNET - Right - THT; LCSC Part #: C125068; JLC Availability: Extended
Jout = XT60PW_M: J - JACK - POWER - XT60 - RIGHT - MALE; LCSC Part #: X; JLC Availability: None
L1-L12 L200 = SWRB1207S-221MT: L - INDUCTOR - 220uH - 1.6A - 12.5mm; Isat: 1.6A; LCSC Part #: C169380; JLC Availability: Extended
Q_LEDA Q_LEDB Q_LEDVSS Qscl Qsda = 2N7002: Q - TRANSISTOR - MOSFET (N) - 60V - 200mW; WVDC: 60; JLC Availability: Basic; LCSC Part #: C8545
Qbg1 Qbg2 Qtg1 Qtg2 = FDB33N25TM: Q - TRANSISTOR - MOSFET (N) - 250V - 33A - 0.094R; WVDC: 250; LCSC Part #: C241752; JLC Availability: Extended
Qsu = MMBT3904: Q - TRANSISTOR - BJT - NPN - 40V 200mA; JLC Availability: Basic; LCSC Part #: C20526
R1 R10 Rcs = FMF25FPJR005-LH: R - RESISTOR - SMD - 0.005R - 1% - 2512 - 2W; LCSC Part #: C371096; JLC Availability: Extended; ComponentLink1URL: http://riedon.com/media/pdf/CSR.pdf; ComponentLink1Description: http://riedon.com/media/pdf/CSR.pdf; Power: 2W
R21 = 0402WGF470JTCE: R - RESISTOR - SMD - 47R - 1% - 0402; LCSC Part #: C25118; JLC Availability: Basic
R26 R45 R47 R48 Rbg1s Rbg2s Rovs Rpsufb1 Rscl Rsda Rtg1s Rtg2s = 0402WGF1002TCE: R - RESISTOR - SMD - 10k - 1% - 0402; LCSC Part #: C25744; JLC Availability: Basic
R28 Rcl1 = 0402WGF3302TCE: R - RESISTOR - SMD - 33k - 1% - 0402; LCSC Part #: C25779; JLC Availability: Basic
R29-R31 R160 R_LEDA_O R_LEDB_O Ragnd Rpsu1 Rpsu2 = 0402WGF0000TCE: R - RESISTOR - SMD - 0R - 1% - 0402; LCSC Part #: C17168; JLC Availability: Basic
R38 = 0402WGF4701TCE: R - RESISTOR - SMD - 4.7k - 1% - 0402; LCSC Part #: C25900; JLC Availability: Basic
R39-R41 = 0402WGF1004TCE: R - RESISTOR - SMD - 1M - 1% - 0402; LCSC Part #: C26083; JLC Availability: Basic
R100-R103 Rcsg Rcsp = 0402WGF1000TCE: R - RESISTOR - SMD - 100R - 1% - 0402; LCSC Part #: C25076; JLC Availability: Basic
R110 R140 = 1206W4F100JT5E: R - RESISTOR - SMD - 10R - 1% - 1206; LCSC Part #: C17903; JLC Availability: Basic
R_1A_a R_1A_b R_1B_a R_1B_b Ron_c = 0402WGF4702TCE: R - RESISTOR - SMD - 47k - 1% - 0402; LCSC Part #: C25792; JLC Availability: Basic
R_1A_c R_1B_c Rcl2 Rsu1 = 0402WGF1003TCE: R - RESISTOR - SMD - 100k - 1% -  0402; LCSC Part #: C25741; JLC Availability: Basic
Rbg1a Rbg1b Rbg2a Rbg2b Rbin Rbout Rtg1a Rtg1b Rtg2a Rtg2b = 0402WGF100JTCE: R - RESISTOR - SMD - 10R - 1% - 0402; LCSC Part #: C25077; JLC Availability: Basic
Riin Riout Rnc4 Rpm = 0402WGF5602TCE: R - RESISTOR - SMD - 56k - 1% - 0402; LCSC Part #: C25796; JLC Availability: Basic
Riinsns1 Riinsns2 Rioutsns1 Rioutsns2 = 0603WAF6800T5E: R - RESISTOR - SMD - 680R - 1% - 0603; LCSC Part #: C23228; JLC Availability: Basic
Ron = 0402WGF2003TCE: R - RESISTOR - SMD - 200k - 1% - 0402; LCSC Part #: C25764; JLC Availability: Basic
Rpsufb2 = 0402WGF3301TCE: R - RESISTOR - SMD - 3.3k - 1% - 0402; LCSC Part #: C25890; JLC Availability: Basic
Rrst Rsu5 = 0402WGF1001TCE: R - RESISTOR - SMD - 1k - 1% - 0402; LCSC Part #: C11702; JLC Availability: Basic
Rsu2 Rsu3 = 0603WAF2703T5E: R - RESISTOR - SMD - 270k - 1% - 0603; LCSC Part #: C22965; JLC Availability: Basic
Rsu4 = 0402WGF3303TCE: R - RESISTOR - SMD - 330k - 1% - 0402; LCSC Part #: C25778; JLC Availability: Basic
Rvinb Rvoutb = 0603WAF1002T5E: R - RESISTOR - SMD - 10k - 1% - 0603; LCSC Part #: C25804; JLC Availability: Basic
Rvint Rvoutt = 0603WAF100KT5E: R - RESISTOR - SMD - 100k - 1% -  0603; LCSC Part #: C22936; JLC Availability: Basic
SWrst = TS-1187A-C-C-B: SW - SWITCH - SPST - NO - Top Actuated Surface Mount; LCSC Part #: C318889; JLC Availability: Extended
U5V2 = 78L05G-AB3-R: U - IC - 5V Power Regulator; VOut: 5.0; LCSC Part #: C71136; JLC Availability: Basic
U8 = SM72442: Programmable Maximum Power Point Tracking Controller for Photovoltaic Solar Panels; Manufacturer: National Semiconductor; CompType: MPPT Controller; PackageTopMarking: S02442; RoHS: Y; PartNumber: SM72442; PackageReference: MTC28_L; ComponentLink1Description: Solar Magic Website; ComponentLink1URL: http://www.solarmagic.com; PackageDescription: TSSOP-28; PinCount: 28
Ugd = SM72295: Photovoltaic Full Bridge Driver; Manufacturer: National Semiconductor; PackageTopMarking: S13051; ComponentLink1Description: Solar Magic Website; ComponentLink1URL: http://www.solarmagic.com; CompType: Driver; PackageReference: M28B_N; PartNumber: SM72295; RoHS: Y; PinCount: 28; PackageDescription: SOIC-28
Upsu = LM5008MMX/NOPB: U - IC - BUCK CONVERTER, ADJUSTABLE, 95V, 350mA; Package: None; Price: None; Value: *; MP: LM5008MMX/NOPB; Availability: Unavailable
Urst = TL7705ACD: U - IC - 5-V single-supply voltage supervisor with programmable delay time 8-PDIP 0 to 70; MP: TL7705ACP; MF: Texas Instruments; Availability: Extended; SnapEDA_Link: https://www.snapeda.com/parts/TL7705ACP/Texas%20Instruments/view-part/130871/?ref=snap; LCSC Part #: C350569; Value: *; Purchase-URL: https://pricing.snapeda.com/search/part/TL7705ACP/?ref=eda; Package: SOIC-8; Price: None